# Altium project GeekIMU.PrjPCB
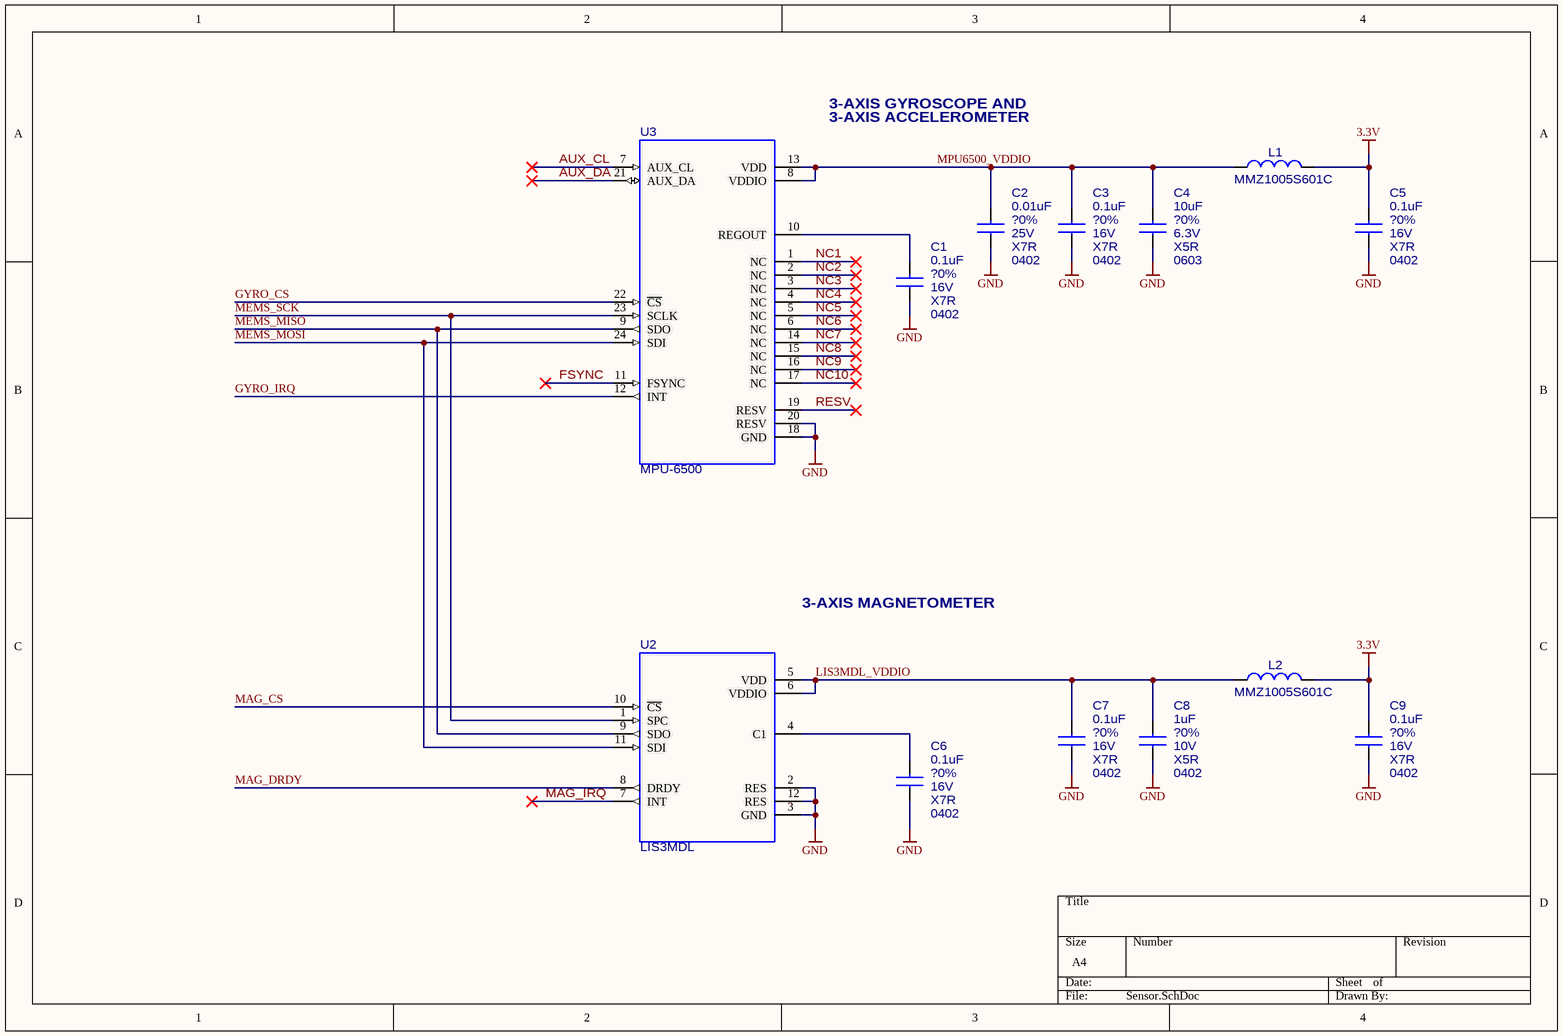
[diagram p0: Sensor.SchDoc]
3 sheets, 22 parts. Net scope: global (net labels, ports and power ports of the same name join across sheets).
Board file: GeekIMU.PcbDoc
Sheets:
  Sensor.SchDoc
  Power.SchDoc
  USB.SchDoc

## Sheet Sensor.SchDoc
size A4

### Parts
(Parts that share a designator on the sheet are numbered #1, #2 ... from top to bottom, then left to right.)
C1  0.1uF  Tolerance: ?0%  Voltage: 16V  Dielectric: X7R  Package: 0402  [CAP_CERAMIC_0402]
C2  0.01uF  Tolerance: ?0%  Voltage: 25V  Dielectric: X7R  Package: 0402  [CAP_CERAMIC_0402]
C3  0.1uF  Tolerance: ?0%  Voltage: 16V  Dielectric: X7R  Package: 0402  [CAP_CERAMIC_0402]
C4#1  10uF  Tolerance: ?0%  Voltage: 6.3V  Dielectric: X5R  Package: 0603  [CAP_CERAMIC_0603]
C5  0.1uF  Tolerance: ?0%  Voltage: 16V  Dielectric: X7R  Package: 0402  [CAP_CERAMIC_0402]
C6  0.1uF  Tolerance: ?0%  Voltage: 16V  Dielectric: X7R  Package: 0402  [CAP_CERAMIC_0402]
C7#1  0.1uF  Tolerance: ?0%  Voltage: 16V  Dielectric: X7R  Package: 0402  [CAP_CERAMIC_0402]
C8  1uF  Tolerance: ?0%  Voltage: 10V  Dielectric: X5R  Package: 0402  [CAP_CERAMIC_0402]
C9  0.1uF  Tolerance: ?0%  Voltage: 16V  Dielectric: X7R  Package: 0402  [CAP_CERAMIC_0402]
L1  MMZ1005S601C  [INDUCTOR_0402]
L2  MMZ1005S601C  [INDUCTOR_0402]
U2  LIS3MDL  [LGA-12]
U3  MPU-6500  [QFN-24]

### Nets
3.3V: C5.1 C9.1 L1.2 L2.2
GND: C1.2 C2.2 C3.2 C4#1.2 C5.2 C6.2 C7#1.2 C8.2 C9.2 U2.2(RES) U2.3(GND) U2.12(RES) U3.18(GND) U3.20(RESV)
AUX_CL: U3.7(AUX_CL)
AUX_DA: U3.21(AUX_DA)
FSYNC: U3.11(FSYNC)
GYRO_CS: U3.22(~{CS})
GYRO_IRQ: U3.12(INT)
LIS3MDL_VDDIO: C7#1.1 C8.1 L2.1 U2.5(VDD) U2.6(VDDIO)
MAG_CS: U2.10(~{CS})
MAG_DRDY: U2.8(DRDY)
MAG_IRQ: U2.7(INT)
MEMS_MISO: U2.9(SDO) U3.9(SDO)
MEMS_MOSI: U2.11(SDI) U3.24(SDI)
MEMS_SCK: U2.1(SPC) U3.23(SCLK)
MPU6500_VDDIO: C2.1 C3.1 C4#1.1 L1.1 U3.8(VDDIO) U3.13(VDD)
NC1: U3.1(NC)
NC2: U3.2(NC)
NC3: U3.3(NC)
NC4: U3.4(NC)
NC5: U3.5(NC)
NC6: U3.6(NC)
NC7: U3.14(NC)
NC8: U3.15(NC)
NC9: U3.16(NC)
NC10: U3.17(NC)
RESV: U3.19(RESV)
NetC1_1: C1.1 U3.10(REGOUT)
NetC6_1: C6.1 U2.4(C1)

### Notes on the sheet
- 3-AXIS GYROSCOPE AND
- (near U3) 3-AXIS ACCELEROMETER
- 3-AXIS MAGNETOMETER

### Library data of the parts
C1 C3 C5 C6 C7#1 C9 = CAP, CERAMIC: CAP, CERAMIC, 0.1uF, ?0%, 16V, X7R, 0402; Manufacturer: MURATA ELECTRONICS; Part Number: GRM155R71C104KA88D
C2 = CAP, CERAMIC: CAP, CERAMIC, 0.01uF, ?0%, 25V, X7R, 0402; Manufacturer: MURATA ELECTRONICS; Part Number: GRM155R71E103KA01D
C4#1 = CAP, CERAMIC: CAP, CERAMIC, 10uF, ?0%, 6.3V, X5R, 0603; Manufacturer: MURATA ELECTRONICS; Part Number: GRM188R60J106ME47D
C8 = CAP, CERAMIC: CAP, CERAMIC, 1uF, ?0%, 10V, X5R, 0402; Manufacturer: MURATA ELECTRONICS; Part Number: GRM155R61A105KE15D
L1 L2 = INDUCTOR: FERRITE CHIP BEAD, 600 OHM @ 100MHz, 300mA, 0402; Manufacturer: TDK CORPORATION; Part Number: MMZ1005S601C; Package: 0402
U2 = LIS3MDL: IC, MEMS 3 AXIS MAGNETOMETER; Manufacturer: STMICROELECTRONICS; Part Number: LIS3MDLTR; Verified Pinout: *
U3 = MPU-6500: IC, MEMS 3 AXIS GYROSCOPE AND 3 AXIS ACCELEROMETER; Manufacturer: INVENSENSE; Part Number: MPU-6500; Verified Pinout: *; Updated: *

## Sheet Power.SchDoc
size A4
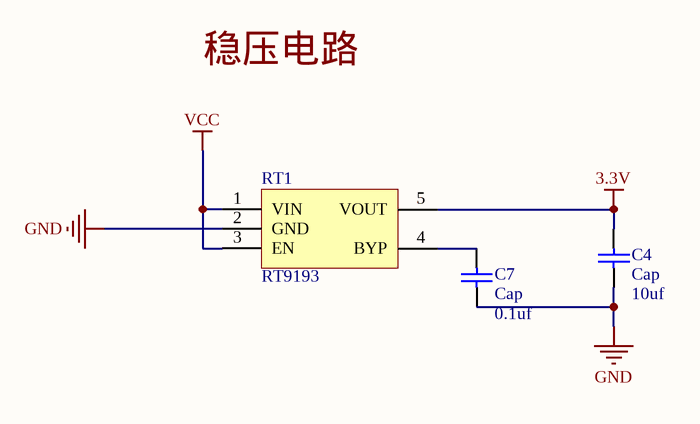
[diagram p1: Power.SchDoc]

### Parts
(Parts that share a designator on the sheet are numbered #1, #2 ... from top to bottom, then left to right.)
C4#2  Cap  value 10uf  [RESISTOR_0603]
C7#2  Cap  value 0.1uf  [CAP_CERAMIC_0402]
RT1  RT9193  [SOT23-5L]

### Nets
3.3V: C4#2.2 RT1.5(VOUT)
GND: C4#2.1 C7#2.1 RT1.2(GND)
VCC: RT1.1(VIN) RT1.3(EN)
NetC7#2_2: C7#2.2 RT1.4(BYP)

### Notes on the sheet
- Labels drawn without touching a wire or pin: 稳压电路

### Library data of the parts
C4#2 C7#2 = Cap: Capacitor; Published: 8-Jun-2000; LatestRevisionDate: 17-Jul-2002; LatestRevisionNote: Re-released for DXP Platform.; PackageReference: RAD-0.3; Publisher: Altium Limited; PackageDescription: Radial Cap, Thru-Hole; 2 Leads; 0.3 in Pin Spacing
RT1 = RT9193: Power

## Sheet USB.SchDoc
size A4
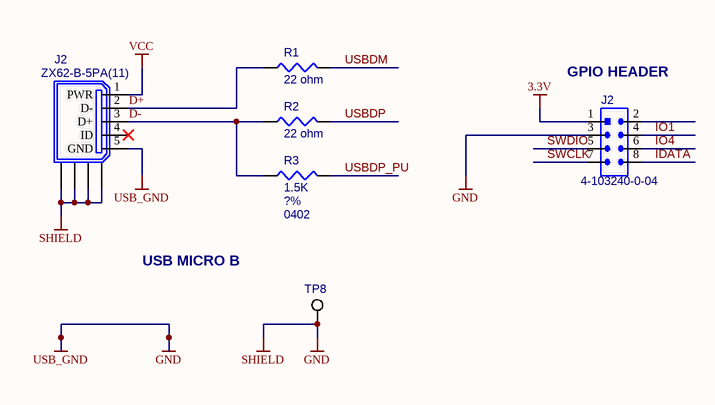
[diagram p2: USB.SchDoc]

### Parts
(Parts that share a designator on the sheet are numbered #1, #2 ... from top to bottom, then left to right.)
J2#1  ZX62-B-5PA(11)  [ZX62-B-5PA(11)]
J2#2  4-103240-0-04  [4-103240-0-04]
R1  22 ohm  [RESISTOR_0402]
R2  22 ohm  [RESISTOR_0402]
R3  1.5K  Package: 0402  Tolerance: ?%  [RESISTOR_0402]
TP8  TEST POINT  [TEST_POINT_PAD]  (value not drawn)  (no BOM)

### Nets
3.3V: J2#2.1
GND: J2#1.5(GND) J2#1.6(SHIELD) J2#1.7(SHIELD) J2#1.8(SHIELD) J2#1.9(SHIELD) J2#2.3 TP8.1  [also labelled SHIELD, USB_GND]
VCC: J2#1.1(PWR)
D+: J2#1.2(D-) R1.1
D-: J2#1.3(D+) R2.1 R3.1
IDATA: J2#2.8
IO1: J2#2.4
IO4: J2#2.6
SWCLK: J2#2.7
SWDIO: J2#2.5
USBDM: R1.2
USBDP: R2.2
USBDP_PU: R3.2

Not connected (* = marked no-connect by the designer): J2#1 4(ID)*; J2#2 2

### Notes on the sheet
- (near J2#2) GPIO HEADER
- USB MICRO B

### Library data of the parts
J2#1 = ZX62-B-5PA(11): CONNECTOR, USB MICRO B, R/A, SMD; Manufacturer: HIROSE; Part Number: ZX62-B-5PA(11)
J2#2 = 4-103240-0-04: CONNECTOR, HEADER, 2X4, 0.1" PITCH; Manufacturer: TE CONNECTIVITY; Part Number: 4-103240-0-04; Pitch: 0.1"
R1 R2 = RESISTOR: RES, 22 OHM, 1/10W, ?%, 0402; Manufacturer: PANASONIC; Part Number: ERJ-2RKF22R0X; Power Rating: 1/10W; Package: 0402; Tolerance: ?%
R3 = RESISTOR: RES, 1.5K OHM, 1/10W, ?%, 0402; Manufacturer: PANASONIC; Part Number: ERJ-2RKF1501X; Power Rating: 1/10W
TP8 = TEST_POINT: Manufacturer: *; Part Number: *

## Nets that join several sheets
3.3V: Sensor (C5.1 C9.1 L1.2 L2.2), Power (C4#2.2 RT1.5), USB (J2#2.1)
GND: Sensor (14 pins), Power (C4#2.1 C7#2.1 RT1.2), USB (7 pins)
VCC: Power (RT1.1 RT1.3), USB (J2#1.1)